# EAGLE design dash_power_supply (EAGLE 7.7.0)

## Sheet 1 of 2
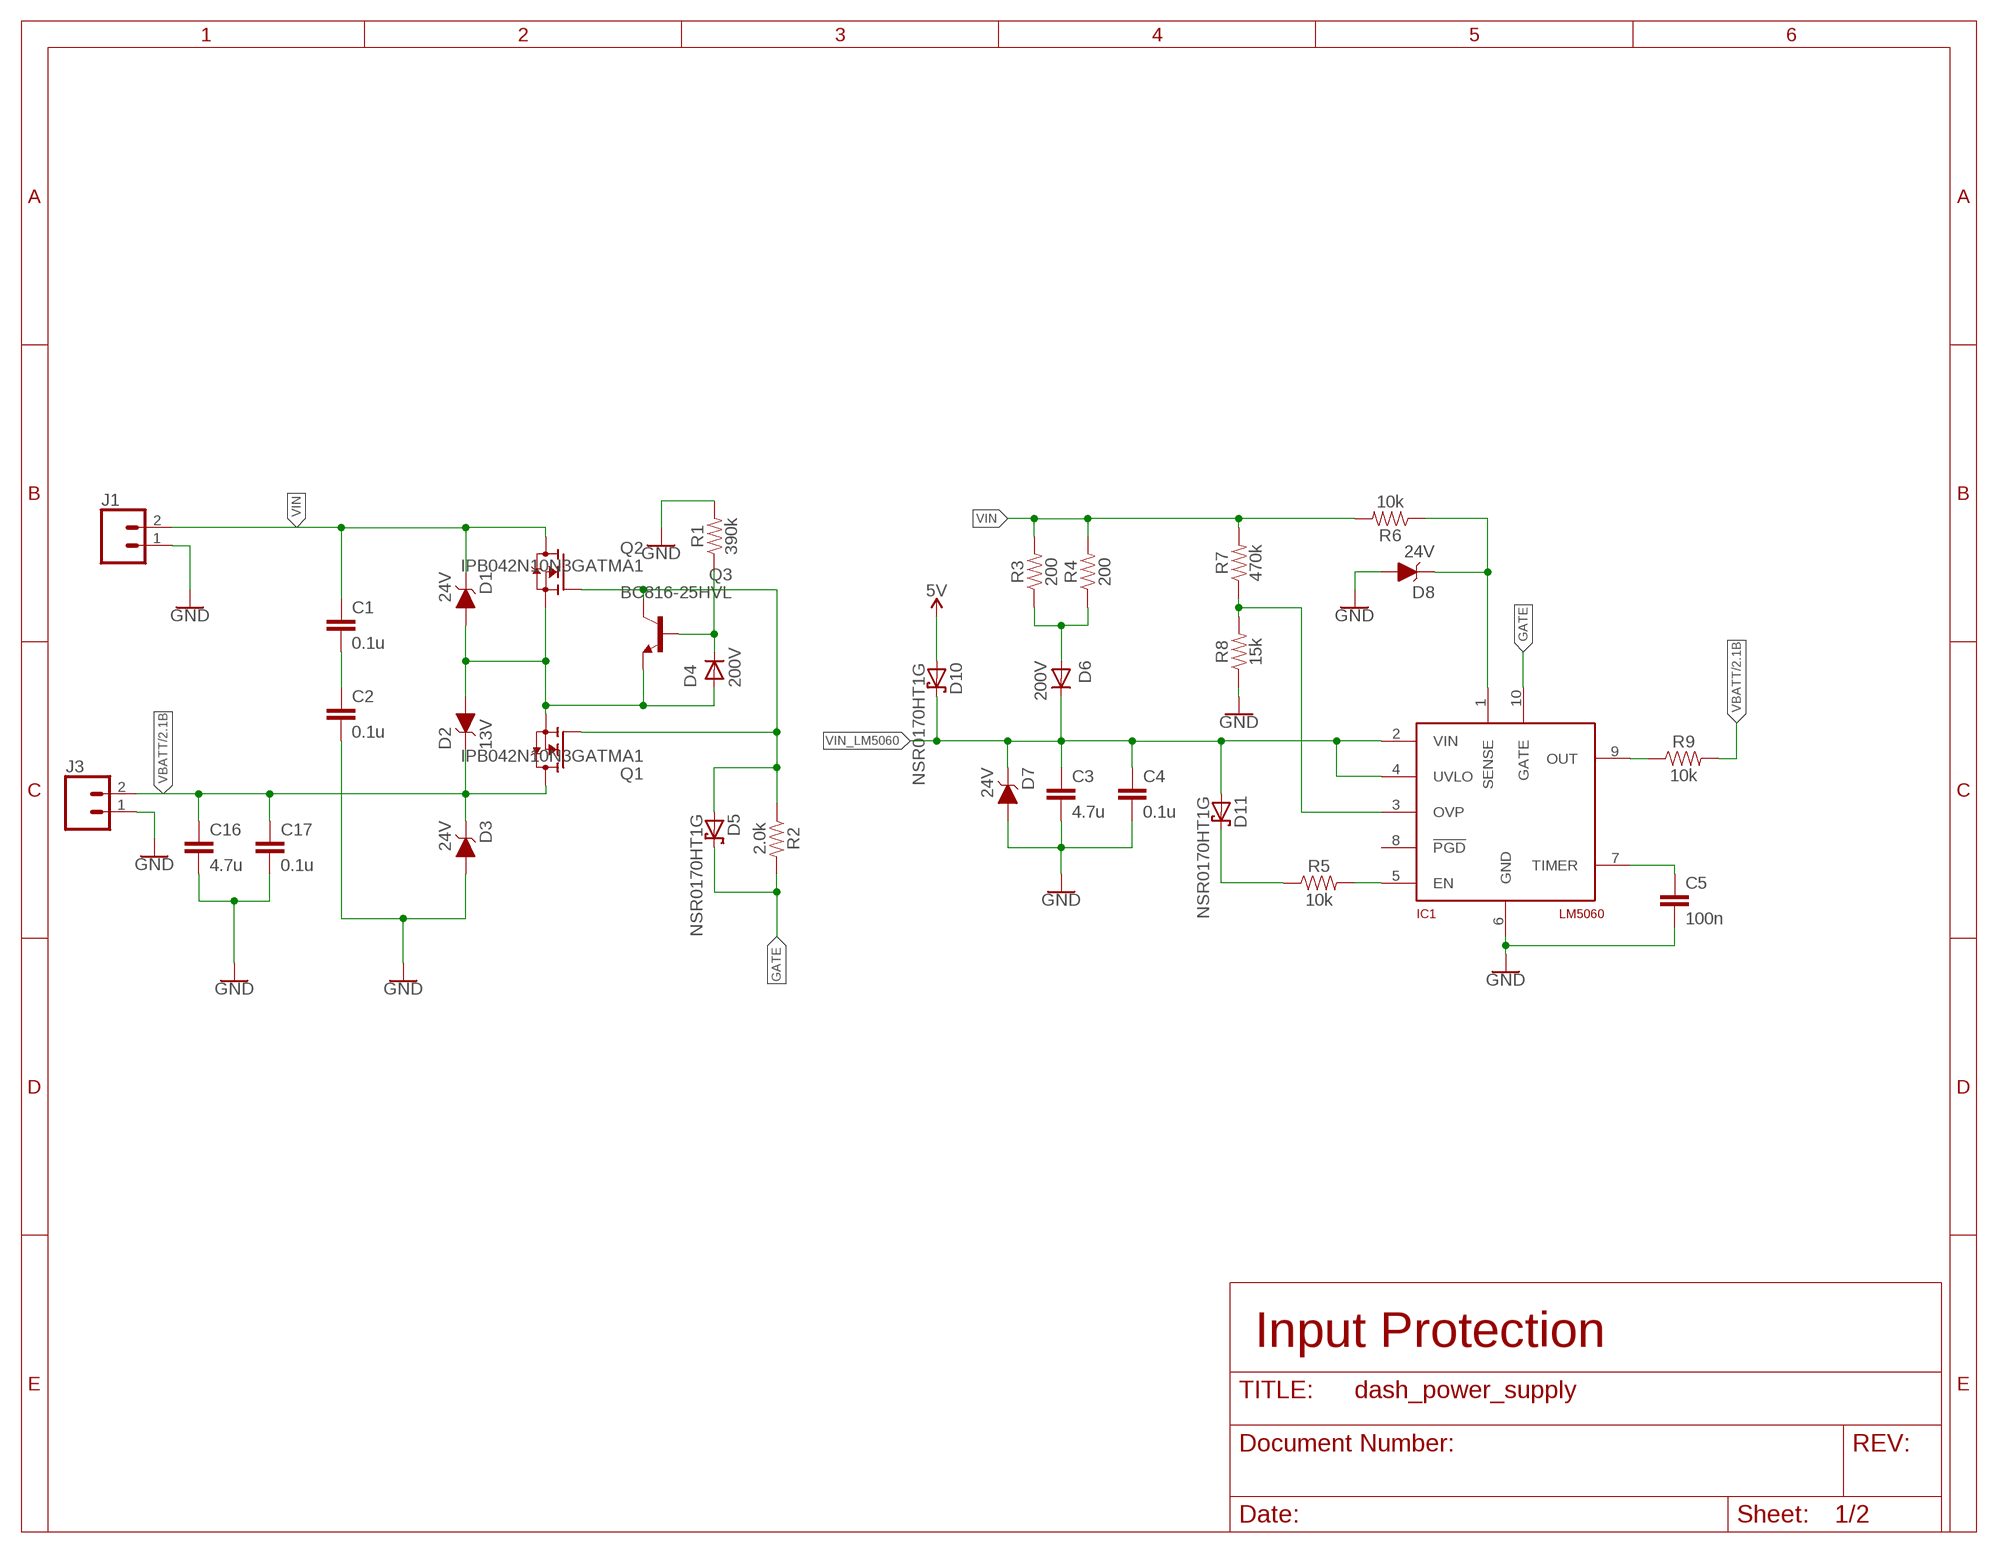
[diagram p0: schematic, sheet 1]

### Parts
C1  0.1u  CL32B104KCFNNWE  [C1210]
C2  0.1u  CL32B104KCFNNWE  [C1210]
C3  4.7u  CL32B475KCVZW6E  [C1210]
C4  0.1u  CL32B104KCFNNWE  [C1210]
C5  100n  CL10B104MB8NNNC  [0603]
C16  4.7u  CL32B475KCVZW6E  [C1210]
C17  0.1u  CL32B104KCFNNWE  [C1210]
D1  24V  5.0SMDJ24A  [SMC]
D2  13V  PTVS13VS1UR,115  [D0-219AB]
D3  24V  5.0SMDJ24A  [SMC]
D4  200V  ES07B-GS18  [D0-219AB]
D5  NSR0170HT1G  [SOD-323]
D6  200V  ES07B-GS18  [D0-219AB]
D7  24V  SZ1SMA24AT3G  [SMA]
D8  24V  SZ1SMA24AT3G  [SMA]
D10  NSR0170HT1G  [SOD-323]
D11  NSR0170HT1G  [SOD-323]
IC1  LM5060  [VSSOP-10]
J1  CONN_02PTH4  [1X02_XTRA_BIG]
J3  CONN_02PTH4  [1X02_XTRA_BIG]
Q1  IPB042N10N3GATMA1  [TO263]
Q2  IPB042N10N3GATMA1  [TO263]
Q3  BC816-25HVL  [SOT23]
R1  390k  390KOHM-0603-1/10W-1%  [0603]
R2  2.0k  2.0KOHM-0603-1/10W-5%  [0603]
R3  200  RESISTOR1206  [1206]
R4  200  RESISTOR1206  [1206]
R5  10k  10KOHM-0603-1/10W-1%  [0603]
R6  10k  10KOHM-0603-1/10W-1%  [0603]
R7  470k  470KOHM  [0603]
R8  15k  15KOHM-0603-1/10W-1%  [0603]
R9  10k  10KOHM-0603-1/10W-1%  [0603]

### Nets
5V: D10.A ; also sheet 2
G: D5.A Q1.1(G) Q2.1(G) Q3.3(C) R2.1
GATE: D5.C IC1.10(GATE) R2.2
GND: C2.2 C3.2 C4.2 C5.2 C16.2 C17.2 D3.A D7.A D8.A IC1.6(GND) J1.1 J3.1 R1.2 R8.1 ; also sheet 2
N$2: C1.2 C2.1
N$3: IC1.5(EN) R5.2
N$4: D6.A R3.1 R4.1
N$6: D8.C IC1.1(SENSE) R6.1
N$7: D4.C Q3.1(B) R1.1
N$8: IC1.3(OVP) R7.1 R8.2
N$9: C5.1 IC1.7(TIMER)
N$10: IC1.9(OUT) R9.1
N$23: D11.C R5.1
VBATT: C16.1 C17.1 D2.C D3.C J3.2 Q1.3(D) R9.2 ; also sheet 2
VIN: C1.1 D1.C J1.2 Q2.3(D) R3.2 R4.2 R6.2 R7.2
VIN_INTERNAL: D1.A D2.A D4.A Q1.2(S) Q2.2(S) Q3.2(E)
VIN_LM5060: C3.1 C4.1 D6.C D7.C D10.C D11.A IC1.2(VIN) IC1.4(UVLO)
Unconnected: IC1.8(!PGD)

### Notes on the sheet
- Input Protection

## Sheet 2 of 2
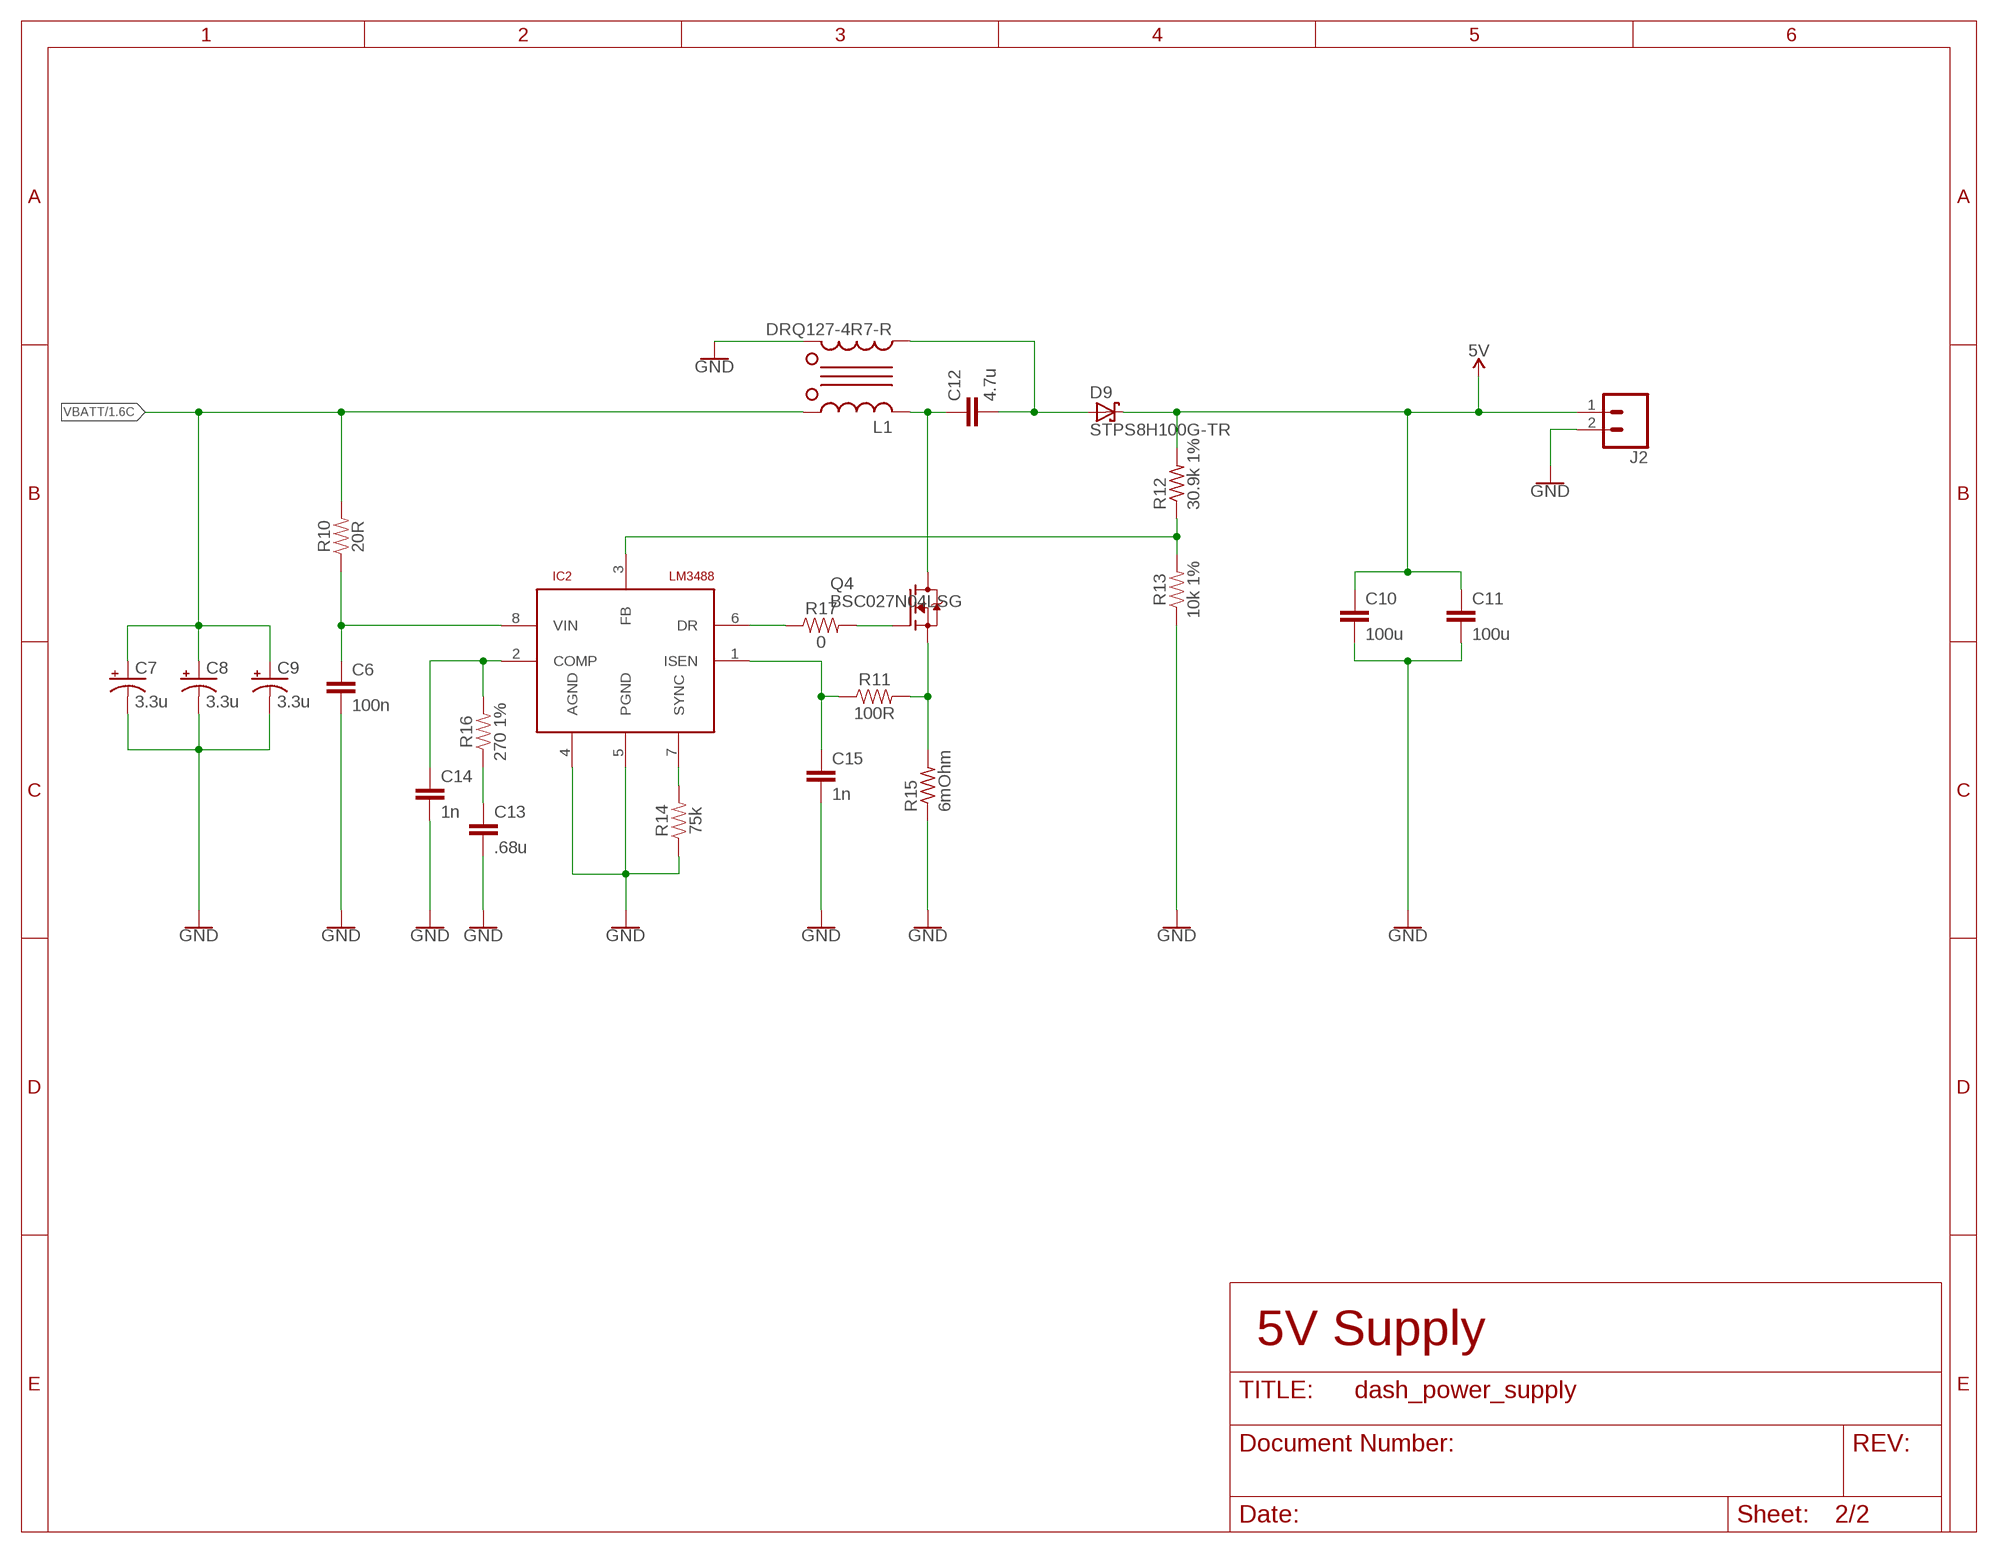
[diagram p1: schematic, sheet 2]

### Parts
C6  100n  CL10B104MB8NNNC  [0603]
C7  3.3u  EEV-FK1K3R3R  [PANASONIC_C]
C8  3.3u  EEV-FK1K3R3R  [PANASONIC_C]
C9  3.3u  EEV-FK1K3R3R  [PANASONIC_C]
C10  100u  CL32A107MPVNNNE  [C1210]
C11  100u  CL32A107MPVNNNE  [C1210]
C12  4.7u  CL10A475KL8NRNC  [0603]
C13  .68u  CL10B684KO8NFNC  [0603]
C14  1n  CL10B102KB8NNWC  [0603]
C15  1n  CL10B102KB8NNWC  [0603]
D9  STPS8H100G-TR  [TO263]
IC2  LM3488  [VSSOP-8]
J2  CONN_02PTH4  [1X02_XTRA_BIG]
L1  DRQ127-4R7-R  [DRQ127]
Q4  BSC027N04LSG  [TDSON]
R10  20R  RC0603JR-0720RL  [0603]
R11  100R  RC0603JR-07100RL  [0603]
R12  30.9k 1%  RC1206FR-0730K9L  [R1206]
R13  10k 1%  RC0603FR-1010KL  [0603]
R14  75k  75KOHM-0603-1/10W-1%  [0603]
R15  6mOhm  PRL1632-R006-F-T1  [3216]
R16  270 1%  RC0603FR-07270RL  [0603]
R17  0  0OHM-0603-1/10W  [0603]

### Nets
5V: C10.1 C11.1 D9.3(C) J2.1 R12.2 ; also sheet 1
GND: C6.2 C7.- C8.- C9.- C10.2 C11.2 C13.2 C14.2 C15.2 IC2.4(AGND) IC2.5(PGND) J2.2 L1.2 R13.1 R14.1 R15.1 ; also sheet 1
N$11: Q4.4(G) R17.2
N$12: C6.1 IC2.8(VIN) R10.1
N$13: IC2.3(FB) R12.1 R13.2
N$15: IC2.6(DR) R17.1
N$16: C15.1 IC2.1(ISEN) R11.1
N$17: Q4.1(S) Q4.2(S) Q4.3(S) R11.2 R15.2
N$18: C12.1 L1.3 Q4.5(D)
N$19: C12.2 D9.2(A) L1.4
N$20: C14.1 IC2.2(COMP) R16.2
N$21: C13.1 R16.1
N$22: IC2.7(SYNC) R14.2
VBATT: C7.+ C8.+ C9.+ L1.1 R10.2 ; also sheet 1

### Notes on the sheet
- 5V Supply

## Library data of the parts
C1-C4 C16 C17 = dash_power_supply:CL32; VOLTAGE: 100V
C5 C6 C14 C15 = digital_dash:CL; VOLTAGE: 50V
C7-C9 = dash_power_supply:EEV-FK; VOLTAGE: 80v
C10 C11 = dash_power_supply:CL32; VOLTAGE: 10V
C12 = digital_dash:CL; VOLTAGE: 35V
C13 = digital_dash:CL; VOLTAGE: 16V
D1 D3 = dash_power_supply:5.0SMDJ
D2 = dash_power_supply:PTVS
D4 D6 = dash_power_supply:ES07B; VF: 980mV
D5 D10 D11 = dash_power_supply:NSR0170HT1G
D7 D8 = dash_power_supply:SZ1SMA
D9 = dash_power_supply:STPS8H100G-TR
IC1 = dash_power_supply:LM5060
IC2 = dash_power_supply:LM3488
J1-J3 = SparkFun-Connectors:CONN_02: Multi connection point. Often used as Generic Header-pin footprint for 0.1 inch spaced/style header connections On any of the 0.1 inch spaced packages, you can populate with these: Break Away Headers - Straight <https://www.sparkfun.com/products/116> (PRT-00116) Break Away Male Headers - Right Angle <https://www.sparkfun.com/products/553> (PRT-00553) Female Headers <https://www.sparkfun.com/products/115> (PRT-00115) Break Away Headers - Machine Pin <https://www.sparkfun.com/products/117> (PRT-00117) Break Away Female Headers - Swiss Machine Pin <https://www.sparkfun.com/products/743> (PRT-00743) For SCREWTERMINALS and SPRING TERMINALS visit here: Screw Terimnals on SparkFun.com <https://www.sparkfun.com/search/results?term=Screw+Terminals> (5mm/3.5mm/2.54mm spacing) This device is also useful as a general connection point to wire up your design to another part of your project. Our various solder wires solder well into these plated through hole pads. Hook-Up Wire - Assortment (Stranded, 22 AWG) <https://www.sparkfun.com/products/11375> (PRT-11375) Hook-Up Wire - Assortment (Solid Core, 22 AWG) <https://www.sparkfun.com/products/11367> (PRT-11367) View the entire wire category on our website here <https://www.sparkfun.com/categories/141> Special notes: Molex polarized connector foot print use with: PRT-08233 with associated crimp pins and housings. 2.54_SCREWTERM for use with PRT-10571. 3.5mm Screw Terminal footprints for PRT-08084 5mm Screw Terminal footprints for use with PRT-08432
L1 = dash_power_supply:DRQ127
Q1 Q2 = dash_power_supply:IPB042N10N3GATMA1
Q3 = dash_power_supply:BC816
Q4 = dash_power_supply:BSC027N04LSG
R1 = SparkFun-Resistors:390KOHM: 390kΩ resistor A resistor is a passive two-terminal electrical component that implements electrical resistance as a circuit element. Resistors act to reduce current flow, and, at the same time, act to lower voltage levels within circuits. - Wikipedia; PROD_ID: RES-12024
R2 = SparkFun-Resistors:2.0KOHM: 2kΩ resistor A resistor is a passive two-terminal electrical component that implements electrical resistance as a circuit element. Resistors act to reduce current flow, and, at the same time, act to lower voltage levels within circuits. - Wikipedia; PROD_ID: RES-08296
R3 R4 = SparkFun-Resistors:RESISTOR: Generic Resistor Package
R5 R6 R9 = SparkFun-Resistors:10KOHM: 10kΩ resistor A resistor is a passive two-terminal electrical component that implements electrical resistance as a circuit element. Resistors act to reduce current flow, and, at the same time, act to lower voltage levels within circuits. - Wikipedia; PROD_ID: RES-00824
R7 = SparkFun-Resistors:470KOHM; PROD_ID: RES-16181
R8 = SparkFun-Resistors:15KOHM: 15kΩ resistor A resistor is a passive two-terminal electrical component that implements electrical resistance as a circuit element. Resistors act to reduce current flow, and, at the same time, act to lower voltage levels within circuits. - Wikipedia; PROD_ID: RES-07854
R10 R11 = digital_dash:RC0603JR
R12 = dash_power_supply:RC1206FR; POWER: .25W
R13 R16 = digital_dash:RC0603FR
R14 = SparkFun-Resistors:75KOHM: 75kΩ resistor A resistor is a passive two-terminal electrical component that implements electrical resistance as a circuit element. Resistors act to reduce current flow, and, at the same time, act to lower voltage levels within circuits. - Wikipedia; PROD_ID: RES-09737
R15 = dash_power_supply:PRL1632; POWER: 1W
R17 = SparkFun-Resistors:0OHM: 0Ω resistor A resistor is a passive two-terminal electrical component that implements electrical resistance as a circuit element. Resistors act to reduce current flow, and, at the same time, act to lower voltage levels within circuits. - Wikipedia; PROD_ID: RES-08609

## Board
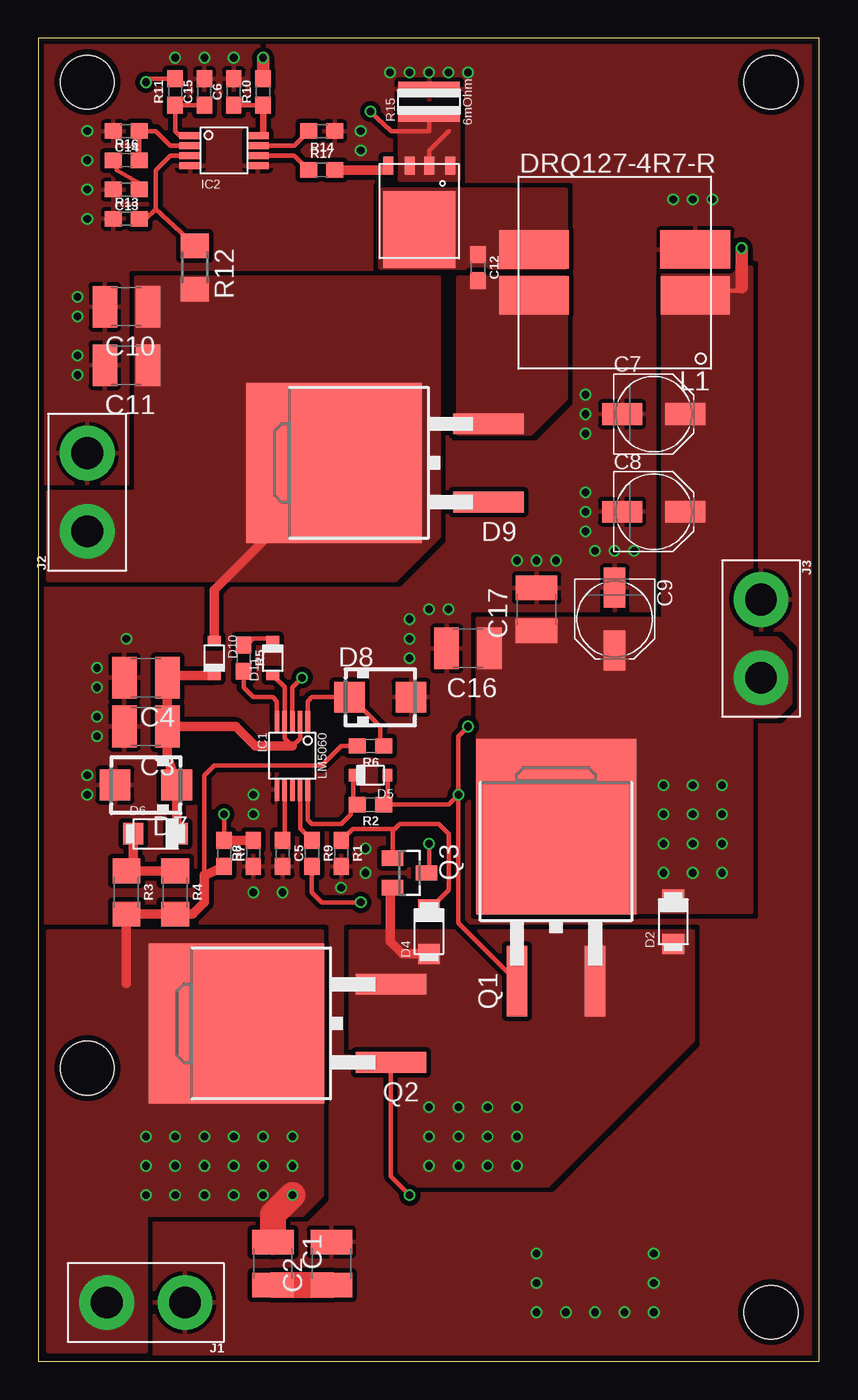
[diagram p2: board, top side]
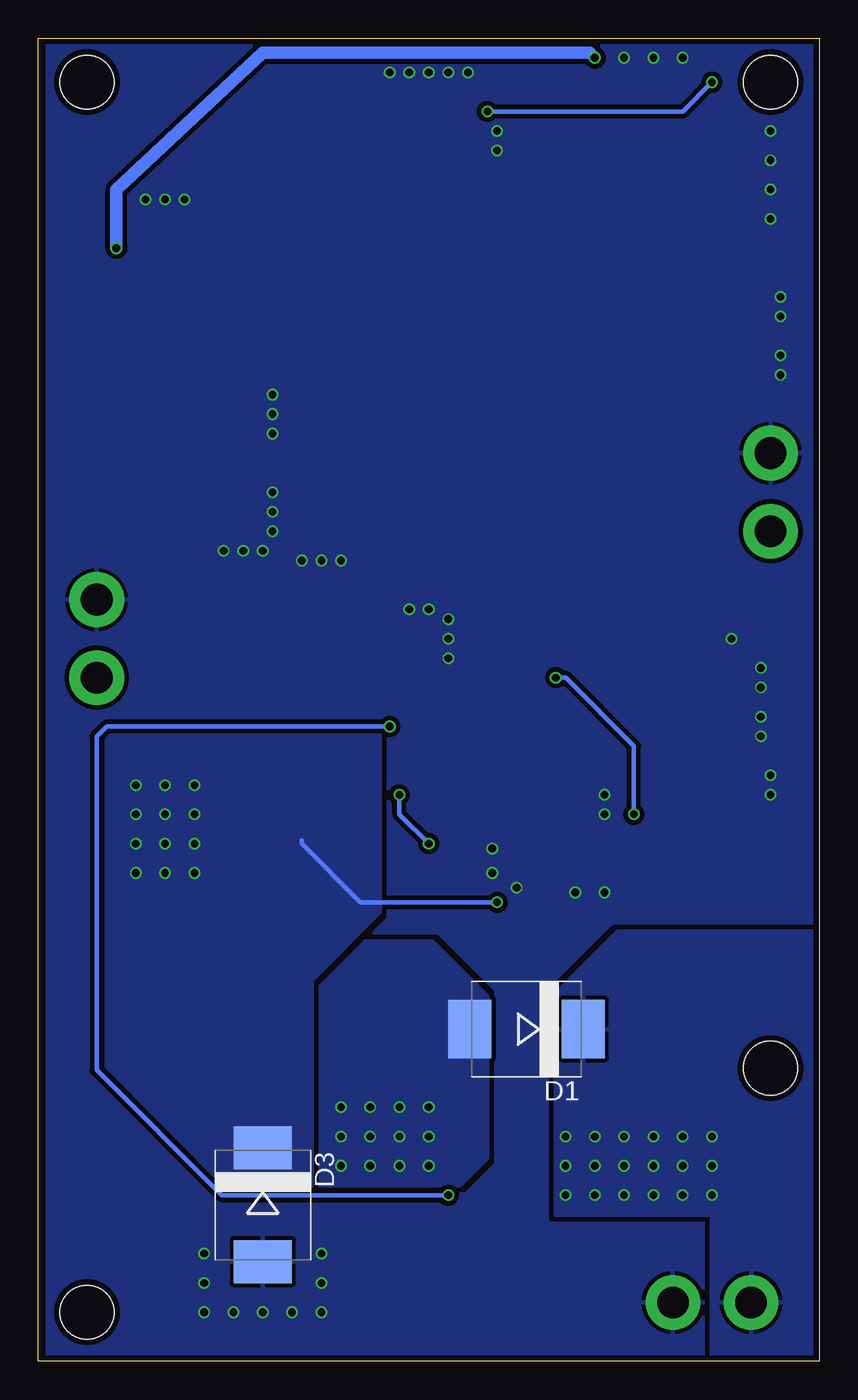
[diagram p3: board, bottom side, seen from below]

Size 50.78 x 86.03 mm. Coordinates in mm from the lower left corner, seen from the top.
Outline: 0,0 50.78,0 50.78,86.03 0,86.03 0,0
Copper layers (1*16): Top 0.035559375mm / dielectric 1.6mm / Bottom 0.035559375mm
Design rules "oshpark-2layer": minimum track width 6mil, minimum drill 10mil, track to track 6mil, track to pad 6mil, pad to pad 6mil, via to via 6mil, smd to smd 6mil, copper to edge 15mil, drill to drill 6mil, minimum pad ring 5mil, minimum via ring 5mil, stop-mask expansion 2.5mil, vias tented up to drill 0mil, thermal gap 10mil
Holes 3.5 mm at 47.62,83.19 47.62,3.17 3.17,83.19 3.17,19.05

### Footprints (pad centres in the part's own frame; a part is rotated, then mirrored left to right if it is on the bottom)
C1210 = smd 1.6 x 2.7: 1 -1.4,0; 2 1.4,0
0603 = smd 1.1 x 1: 1 -0.85,0; 2 0.85,0
PANASONIC_C = smd 2.6 x 1.4: + 2.05,0; - -2.05,0
SMC = smd 2.8 x 3.8: A 3.7,0; C -3.7,0
D0-219AB = smd 1.3 x 1.4: A -1.45,0; C 1.45,0
SOD-323 = smd 0.63 x 0.83: A -1.115,0; C 1.115,0
SMA = smd 2 x 2: A 2,0; C -2,0
TO263 = smd 1.35 x 4.6: 1 -2.54,-5.775; 2 2.54,-5.775 | smd 10.4 x 11.4: 3 0,4.275
VSSOP-10 = smd 1.45 x 0.3: 1 -2.2,1; 2 -2.2,0.5; 3 -2.2,0; 4 -2.2,-0.5; 5 -2.2,-1; 6 2.2,-1; 7 2.2,-0.5; 8 2.2,0; 9 2.2,0.5; 10 2.2,1
VSSOP-8 = smd 1.45 x 0.45: 1 -2.2,0.975; 2 -2.2,0.325; 3 -2.2,-0.325; 4 -2.2,-0.975; 5 2.2,-0.975; 6 2.2,-0.325; 7 2.2,0.325; 8 2.2,0.975
1X02_XTRA_BIG = drill 2.057 pad 3.556: 1 -2.54,0; 2 2.54,0
DRQ127 = smd 4.5 x 2.5: 1 -5.25,1.5; 3 5.25,-1.5; 4 5.25,1.5 | smd 4.55 x 2.5: 2 -5.25,-1.5
SOT23 = smd 1 x 1.4: 1 -0.95,-1.1; 2 0.95,-1.1; 3 0,1.1
TDSON = smd 1.2 x 0.65: 1 -2.95,2.025; 2 -2.95,0.635; 3 -2.95,-0.635; 4 -2.95,-2.025 | smd 5 x 4.7: 5 1.2,0
1206 = smd 1.6 x 1.8: 1 -1.4,0; 2 1.4,0
R1206 = smd 1.6 x 1.803: 1 -1.422,0; 2 1.422,0
3216 = smd 1 x 4: 1 -0.8,0; 2 0.8,0

### Placement (x,y rotation side)
C1  15.24,6.35 270 top
C2  19.05,6.35 90 top
C3  6.99,41.27 180 top
C4  6.99,44.45 180 top
C5  15.88,33.02 270 top
C6  12.7,82.55 90 top
C7  40.01,61.59 0 top
C8  40.01,55.24 0 top
C9  37.47,48.26 270 top
C10  5.71,68.58 180 top
C11  5.71,64.77 180 top
C12  28.57,71.12 270 top
C13  5.71,76.2 180 top
C14  5.71,80.01 180 top
C15  10.79,82.55 90 top
C16  27.94,46.35 180 top
C17  32.38,48.9 90 top
D1  19.05,21.59 180 bottom
D2  41.27,28.57 90 top
D3  36.2,10.16 270 bottom
D4  25.4,27.94 90 top
D5  21.59,38.1 180 top
D6  7.62,34.29 0 top
D7  6.99,37.47 180 top
D8  22.23,43.18 0 top
D9  23.5,58.42 90 top
D10  11.43,45.72 270 top
D11  15.24,45.72 90 top
IC1  16.51,39.37 270 top
IC2  12.06,78.74 0 top
J1  6.99,3.81 180 top
J2  3.17,56.52 90 top
J3  46.99,46.99 270 top
L1  37.47,70.8 180 top
Q1  33.66,30.48 0 top
Q2  17.14,21.97 90 top
Q3  24.13,31.75 270 top
Q4  24.77,74.8 270 top
R1  19.68,33.02 270 top
R2  21.59,36.2 180 top
R3  5.71,30.48 270 top
R4  8.89,30.48 270 top
R5  13.34,45.72 270 top
R6  21.59,40.01 180 top
R7  12.06,33.02 270 top
R8  13.97,33.02 90 top
R9  17.78,33.02 270 top
R10  14.61,82.55 90 top
R11  8.89,82.55 90 top
R12  10.16,71.12 270 top
R13  5.71,74.3 0 top
R14  18.41,80.01 180 top
R15  25.4,81.92 270 top
R16  5.71,78.11 0 top
R17  18.41,77.47 0 top

### Tracks (layer width: path | path; a pad name or v marks a point on that pad's centre or on a via)
5V
  Top 0.61: D10.A 11.43,50.16 19.68,58.42
  pour Top (isolate 0.305, no thermals): 26.04,70.48 26.04,53.64 23.2,50.8 0.64,50.8 0.64,56.52 6.35,56.52 6.35,70.48
G  (via drill 0.5)
  Top 0.305: 22.92,19.05 22.92,12.01 v24.13,10.79 | Q1.1 27.3,28.52 v27.3,36.83 | v27.3,36.83 27.3,40.64 v27.94,41.27 | Q3.3 25.4,31.92 v25.4,33.66 | R2.1 22.7,36.46 | 22.7,36.46 D5.A | 22.7,36.46 22.97,36.2 26.67,36.2 v27.3,36.83
  Top 0.61: 22.92,19.05 Q2.1
  Bottom 0.305: v27.94,41.27 46.35,41.27 46.99,40.64 46.99,18.93 38.86,10.79 v24.13,10.79 | v25.4,33.66 27.3,35.56 v27.3,36.83
GATE
  Top 0.305: D5.C 20.48,36.46 R2.2 20.32,35.77 20.32,35.56 19.68,34.92 17.78,34.92 17.51,35.2 IC1.10
GND  (via drill 0.5)
  other vias: 32.38,6.99 40.01,6.99 13.97,36.83 13.97,35.56 34.29,3.17 36.2,3.17 38.1,3.17 40.01,3.17 40.01,5.08 32.38,5.08 32.38,3.17 24.13,45.72 24.13,46.99 24.13,48.26 25.4,48.9 26.67,48.9 31.11,52.07 32.38,52.07 33.66,52.07 35.56,55.24 35.56,56.52 35.56,53.98 36.2,52.7 37.47,52.7 38.73,52.7 35.56,62.87 35.56,61.59 35.56,60.33 43.81,75.56 42.55,75.56 41.27,75.56 20.95,78.74 20.95,80.01 22.86,83.82 25.4,83.82 27.94,83.82 24.13,83.82 26.67,83.82 8.89,84.77 3.17,80.01 3.17,78.11 3.17,76.2 3.17,74.3 2.54,69.22 2.54,67.94 2.54,65.41 2.54,64.14 3.81,40.64 3.81,41.91 3.81,43.81 3.81,45.09 5.71,46.99 3.17,36.83 3.17,38.1 13.97,30.48 15.88,30.48 19.68,30.8 21.27,33.34 21.27,31.75 10.79,84.77 12.7,84.77
  pour Top (isolate 0.305, rank 4): 0,85.72 50.16,85.72 50.16,0 0,0
  pour Bottom (isolate 0.305, rank 4): 0,85.72 0,0 50.16,0 50.16,85.72
N$2
  Top 1.676: C1.2 C2.1
N$3
  Top 0.305: R5.2 13.34,43.81 13.97,43.18 15.24,43.18 15.51,42.91 IC1.5
N$4
  Top 0.61: R4.1 R3.1 6.17,32.34 D6.A
N$6
  Top 0.305: D8.C 17.78,43.18 17.51,42.91 IC1.1 | R6.1 22.23,40.22 22.23,41.27 20.32,43.18
  Top 0.61: 20.32,43.18 D8.C
N$7
  Top 0.305: D4.C 26.67,30.66 26.67,34.29 26.04,34.92 23.5,34.92 23.18,34.61 | 23.18,34.61 23.03,34.46 Q3.1 | R1.1 20.42,34.61 23.18,34.61
N$8  (via drill 0.5)
  Top 0.305: R7.1 v12.06,35.56 | v17.14,44.45 16.51,43.81 IC1.3
  Top 0.61: R7.1 R8.2
  Bottom 0.305: v12.06,35.56 12.06,40.01 16.51,44.45 v17.14,44.45
N$9
  Top 0.305: C5.1 16.01,34.01 IC1.7
N$10
  Top 0.305: R9.1 17.01,34.64 IC1.9
N$11
  Top 0.61: R17.2 22.46,77.47 Q4.4
N$12
  Top 0.305: 14.73,79.72 14.61,79.72 IC2.8 | R10.1 C6.1
  Top 0.406: R10.1 14.61,79.72
N$13
  Top 0.305: IC2.3 8.56,78.42 7.62,77.47 7.62,74.93 | 7.62,74.93 6.99,74.3 R13.2 | 7.62,74.93 9.68,73.03 R12.1
N$15
  Top 0.305: IC2.6 16.62,78.42 R17.1
N$16
  Top 0.305: IC2.1 9.19,79.72 8.89,80.01 R11.1 C15.1
N$17  (via drill 0.5)
  Top 0.305: 26.67,80.01 25.4,78.74 25.4,77.68 | v21.59,81.28 22.93,80.01 25.4,80.01 25.4,81.22 | v6.99,83.19 7.2,83.4 R11.2
  Bottom 0.305: v6.99,83.19 8.89,81.28 v21.59,81.28
  pour Top (isolate 0.305, no thermals): 23.5,76.83 23.5,81.28 27.3,81.28 27.3,76.83
N$18
  pour Top (isolate 0.305, no thermals): 34.29,71.12 22.23,71.12 22.23,76.2 34.29,76.2
N$19
  pour Top (isolate 0.305, rank 2, no thermals): 34.29,70.48 27.3,70.48 27.3,60.33 32,60.33 34.29,62.61
N$20
  Top 0.305: IC2.2 8.56,79.06 7.62,80.01 C14.1 R16.2
N$21
  Top 0.305: R16.1 5.08,77.89 5.08,77.47 6.57,76.62 C13.1
N$22
  Top 0.305: R14.2 16.62,79.06 IC2.7
N$23
  Top 0.305: D11.C 15.09,46.99 13.97,46.99 13.55,46.57 R5.1
VBATT  (via drill 0.5)
  Top 0.305: 42.44,69.62 45.49,69.62 45.72,69.85 | R9.2 17.78,30.48 18.41,29.84 v20.95,29.84
  Top 0.813: v45.72,72.39 45.72,69.85 | v14.61,84.77 R10.2
  Bottom 0.305: v20.95,29.84 29.84,29.84 33.66,33.66 33.66,33.85
  Bottom 0.813: v45.72,72.39 45.72,76.2 36.2,85.09 14.92,85.09 v14.61,84.77
  other vias: 40.64,37.47 42.55,37.47 44.45,37.47 44.45,35.56 42.55,35.56 40.64,35.56 40.64,33.66 42.55,33.66 44.45,33.66 44.45,31.75 42.55,31.75 40.64,31.75
  pour Bottom (isolate 0.305, no thermals): 33.02,11.43 33.02,24.77 28.57,29.21 28.57,41.91 46.35,41.91 46.35,18.96 38.82,11.43
  pour Top (isolate 0.305, no thermals): 28.57,29.21 46.35,29.21 46.35,41.91 48,41.91 48.9,42.81 48.9,46.09 48,46.99 46.35,46.99 46.35,71.12 40.64,71.12 40.64,48.26 28.57,48.26
VIN  (via drill 0.5)
  Top 0.305: R6.2 19.68,40.01 18.41,38.73 11.43,38.73 10.79,38.1 10.79,31.62
  Top 0.61: 5.71,24.57 R3.2 R4.2 10.03,29.08 10.79,29.84 10.79,31.62 10.88,31.62 R7.2
  Top 1.676: v16.51,10.79 15.24,9.53 C1.1
  other vias: 8.89,10.79 10.79,10.79 12.7,10.79 14.61,10.79 16.51,12.7 14.61,12.7 12.7,12.7 10.79,12.7 8.89,12.7 16.51,14.61 14.61,14.61 12.7,14.61 10.79,14.61 8.89,14.61 6.99,14.61 6.99,12.7 6.99,10.79
  pour Bottom (isolate 0.305): 17.14,9.53 17.14,23.87 13.08,27.94 0,27.94 0,0 6.99,0 6.99,9.53
  pour Top (isolate 0.305, no thermals): 0.64,0.64 6.99,0.64 6.99,9.53 17.14,9.53 18.41,10.79 18.41,27.94 0.64,27.94
VIN_INTERNAL  (via drill 0.5)
  Top 0.61: Q3.2 22.86,30.63 22.86,27.3 23.68,26.49 D4.A
  other vias: 27.3,12.7 25.4,12.7 25.4,14.61 27.3,14.61 29.21,14.61 29.21,12.7 31.11,12.7 31.11,14.61 31.11,16.51 29.21,16.51 27.3,16.51 25.4,16.51
  pour Top (isolate 0.305, no thermals): 42.55,27.94 20.32,27.94 20.32,15.5 24.39,11.43 33.11,11.43 42.55,20.87
  pour Bottom (isolate 0.305, rank 2, no thermals): 21.59,23.71 21.59,13.23 23.39,11.43 33.02,11.43 33.02,27.3 25.18,27.3
VIN_LM5060
  Top 0.305: IC1.2 17.01,40.51 16.51,40.01 16.01,40.51 IC1.4 16.01,43.84 D11.A 15.24,44.45
  Top 0.61: D6.C 8.98,35.01 D7.C 8.38,39.34 C3.1 | C3.1 C4.1 8.54,44.6 D10.C | 16.51,40.01 14.1,40.01 12.83,41.27 C3.1